# EAGLE schematic Stepper driver daughter board + laser v5 (EAGLE 9.7.0)
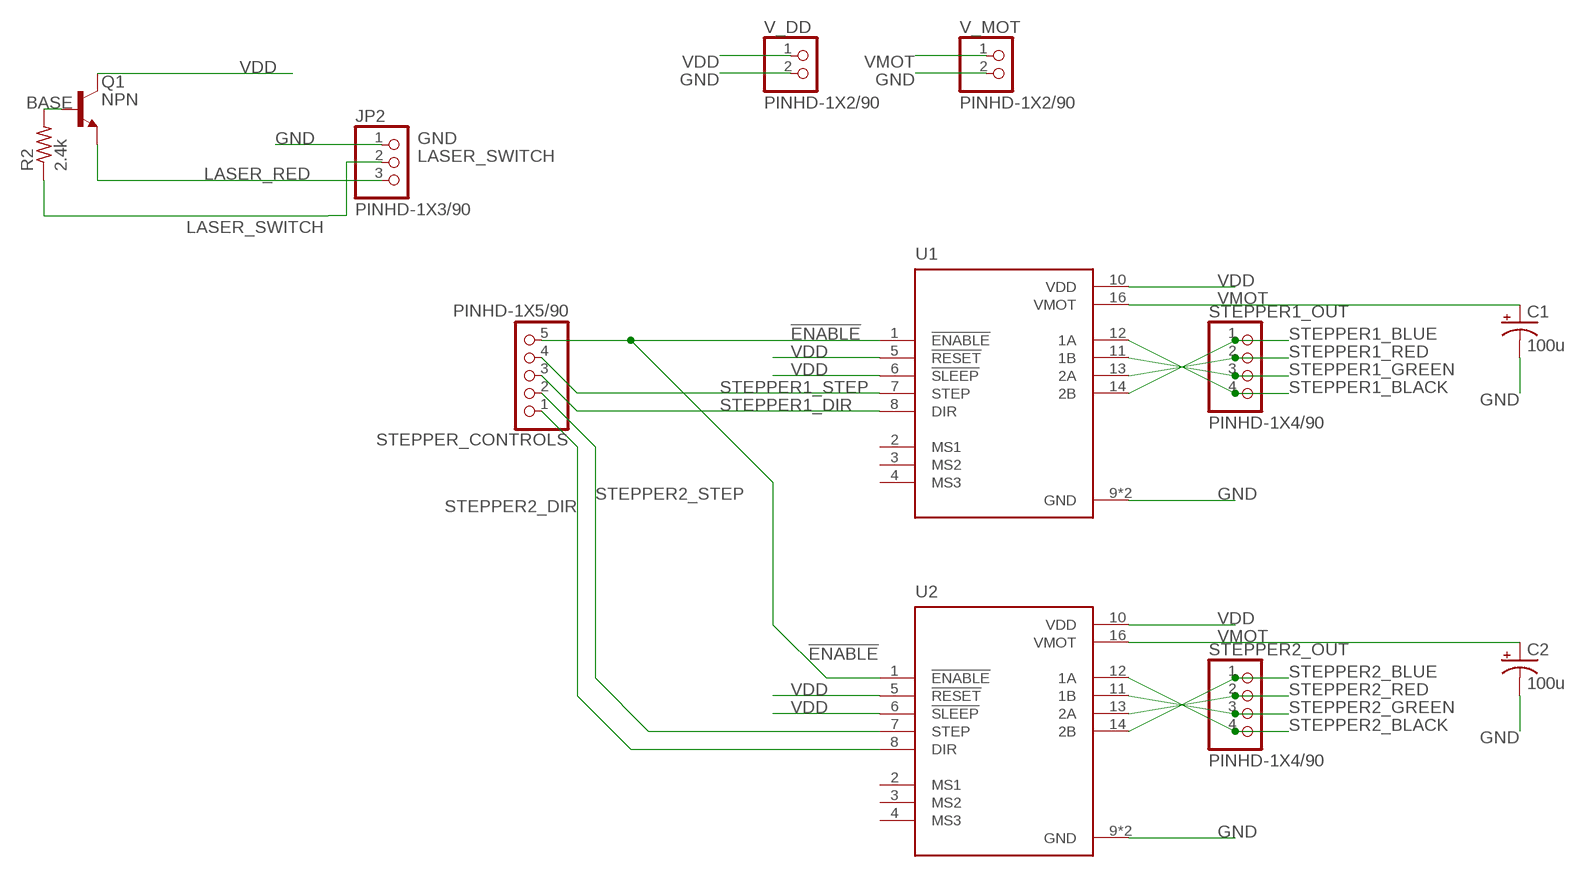
[diagram p0: schematic, sheet 1]

## Parts
C1  100u  CPOL-USE22-6AXIAL  [E22-6]
C2  100u  CPOL-USE22-6AXIAL  [E22-6]
JP2  PINHD-1X3/90  [1X03/90]
Q1  NPN  NPN_TO92-EBC  [TO92]
R2  2.4k  R-US_0207/10  [0207/10]
STEPPER1_OUT  PINHD-1X4/90  [1X04/90]
STEPPER2_OUT  PINHD-1X4/90  [1X04/90]
STEPPER_CONTROLS  PINHD-1X5/90  [1X05/90]
U1  A4988_STEPPER_MOTOR_DRIVER_CARRIER  [MODULE_A4988_STEPPER_MOTOR_DRIVER_CARRIER]
U2  A4988_STEPPER_MOTOR_DRIVER_CARRIER  [MODULE_A4988_STEPPER_MOTOR_DRIVER_CARRIER]
V_DD  PINHD-1X2/90  [1X02/90]
V_MOT  PINHD-1X2/90  [1X02/90]

## Nets
!ENABLE: STEPPER_CONTROLS.5 U1.1(!ENABLE) U2.1(!ENABLE)
BASE: Q1.2(B) R2.2
GND: C1.- C2.- JP2.1 U1.9(GND) U1.15(GND) U2.9(GND) U2.15(GND) V_DD.2 V_MOT.2
LASER_RED: JP2.3 Q1.1(E)
LASER_SWITCH: JP2.2 R2.1
STEPPER1_BLACK: STEPPER1_OUT.4 U1.12(1A)
STEPPER1_BLUE: STEPPER1_OUT.1 U1.14(2B)
STEPPER1_DIR: STEPPER_CONTROLS.3 U1.8(DIR)
STEPPER1_GREEN: STEPPER1_OUT.3 U1.11(1B)
STEPPER1_RED: STEPPER1_OUT.2 U1.13(2A)
STEPPER1_STEP: STEPPER_CONTROLS.4 U1.7(STEP)
STEPPER2_BLACK: STEPPER2_OUT.4 U2.12(1A)
STEPPER2_BLUE: STEPPER2_OUT.1 U2.14(2B)
STEPPER2_DIR: STEPPER_CONTROLS.1 U2.8(DIR)
STEPPER2_GREEN: STEPPER2_OUT.3 U2.11(1B)
STEPPER2_RED: STEPPER2_OUT.2 U2.13(2A)
STEPPER2_STEP: STEPPER_CONTROLS.2 U2.7(STEP)
VDD: Q1.3(C) U1.5(!RESET) U1.6(!SLEEP) U1.10(VDD) U2.5(!RESET) U2.6(!SLEEP) U2.10(VDD) V_DD.1
VMOT: C1.+ C2.+ U1.16(VMOT) U2.16(VMOT) V_MOT.1
Unconnected: U1.2(MS1) U1.3(MS2) U1.4(MS3) U2.2(MS1) U2.3(MS2) U2.4(MS3)

## Library data of the parts
C1 C2 = adafruit:CPOL-US: POLARIZED CAPACITOR, American symbol
JP2 = Connector:PINHD-1X3: PIN HEADER; CATEGORY: Headers; DESCRIPTION: Header, Right Angle, 3 Position; MANUFACTURER: Generic; MPN: Generic; OPERATING_TEMPERATURE: Generic; PART_STATUS: Active; PITCH: 0.100" (2.54mm); ROHS_COMPLIANCE: Generic; SERIES: Generic; SUB-CATEGORY: Headers, Male Pins; TYPE: Board to Board or Cable, Unshrouded, Through Hole, Right Angle
Q1 = Transistor:NPN: NPN - Generic; CATEGORY: Transistor; SUB-CATEGORY: BJT; TYPE: NPN
R2 = adafruit:R-US_: RESISTOR, American symbol
STEPPER1_OUT STEPPER2_OUT = Connector:PINHD-1X4: PIN HEADER; CATEGORY: Headers; DESCRIPTION: Header, Right Angle, 4 Position; MANUFACTURER: Generic; MPN: Generic; OPERATING_TEMPERATURE: Generic; PART_STATUS: Active; PITCH: 0.100" (2.54mm); ROHS_COMPLIANCE: Generic; SERIES: Generic; SUB-CATEGORY: Headers, Male Pins; TYPE: Board to Board or Cable, Unshrouded, Through Hole, Right Angle
STEPPER_CONTROLS = Connector:PINHD-1X5: PIN HEADER; CATEGORY: Headers; DESCRIPTION: Header, Right Angle, 5 Position; MANUFACTURER: Generic; MPN: Generic; OPERATING_TEMPERATURE: Generic; PART_STATUS: Active; PITCH: 0.100" (2.54mm); ROHS_COMPLIANCE: Generic; SERIES: Generic; SUB-CATEGORY: Headers, Male Pins; TYPE: Board to Board or Cable, Unshrouded, Through Hole, Right Angle
U1 U2 = A4988_STEPPER_MOTOR_DRIVER_CARRIER:A4988_STEPPER_MOTOR_DRIVER_CARRIER: Stepper motor controler; IC: A4988; 1A; Uin mot: 8÷35V Check availability <https://pricing.snapeda.com/parts/A4988%20STEPPER%20MOTOR%20DRIVER%20CARRIER/Pololu/view-part?ref=eda>; AVAILABILITY: Not in stock; CHECK_PRICES: https://www.snapeda.com/parts/A4988%20STEPPER%20MOTOR%20DRIVER%20CARRIER/Pololu/view-part/?ref=eda; DESCRIPTION: Stepper Motor Driver; MF: Pololu; MP: A4988 STEPPER MOTOR DRIVER CARRIER; PACKAGE: None; PRICE: None; SNAPEDA_LINK: https://www.snapeda.com/parts/A4988%20STEPPER%20MOTOR%20DRIVER%20CARRIER/Pololu/view-part/?ref=snap
V_DD V_MOT = Connector:PINHD-1X2: PIN HEADER; CATEGORY: Headers; DESCRIPTION: Header, Right Angle, 2 Position; MANUFACTURER: Generic; MPN: Generic; OPERATING_TEMPERATURE: Generic; PART_STATUS: Active; PITCH: 0.100" (2.54mm); ROHS_COMPLIANCE: Generic; SERIES: Generic; SUB-CATEGORY: Headers, Male Pins; TYPE: Board to Board or Cable, Unshrouded, Through Hole, Right Angle